# EAGLE design micro_opto_v1.0 (EAGLE 6.4)
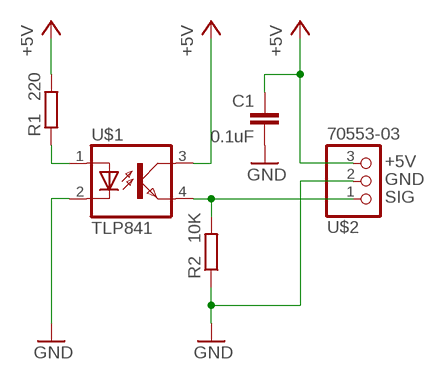
[diagram p0: schematic, sheet 1]

## Parts
C1  0.1uF  C-EUC0805  [C0805]
R1  220  R-EU_R0805  [R0805]
R2  10K  R-EU_R0805  [R0805]
U$1  TLP841  [TLP841]
U$2  70553-03  [70553-03]

## Nets
+5V: C1.1 R1.2 U$1.3(COL) U$2.3
GND: C1.2 R2.1 U$1.2(C) U$2.2
N$2: R1.1 U$1.1(A)
SIG: R2.2 U$1.4(EMIT) U$2.1

## Notes on the sheet
- +5V
- GND
- SIG

## Library data of the parts
C1 = rcl_mod:C-EU: CAPACITOR, European symbol
R1 R2 = rcl_mod:R-EU_: RESISTOR, European symbol
U$1 = TLP841:TLP841
U$2 = 70553-03:70553-03

## Board
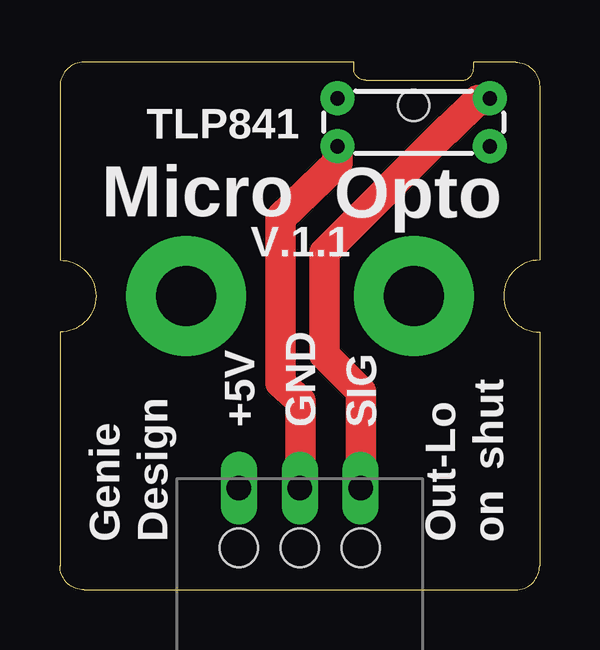
[diagram p1: board, top side]
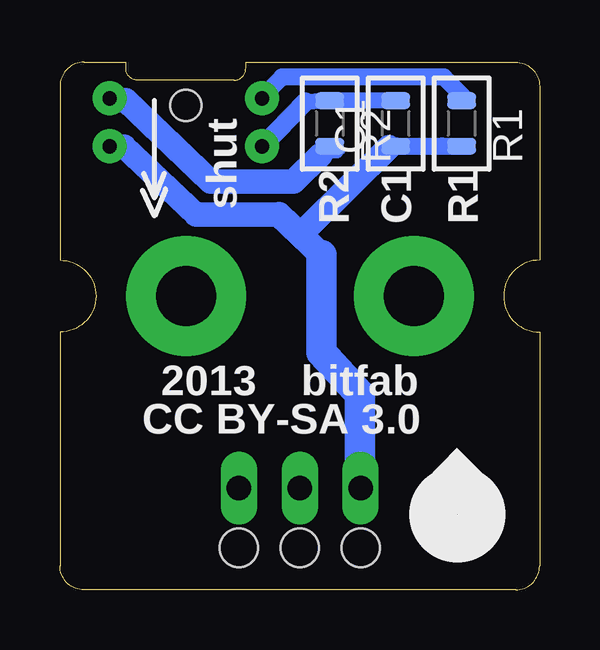
[diagram p2: board, bottom side, seen from below]

Size 20 x 22 mm. Coordinates in mm from the lower left corner, seen from the top.
Outline: 19,22 17.25,22 17.25,21.75 arc-90 16.75,21.25 12.75,21.25 arc-90 12.25,21.75 12.25,22 1,22 arc90 0,21 0,13.75 arc-90 1.5,12.25 arc-90 0,10.75 0,1 arc90 1,0 19,0 arc90 20,1 20,10.75 arc-90 18.5,12.25 arc-90 20,13.75 20,21 arc90 19,22
Copper layers (1*16): Top 0.035mm / dielectric 1.5mm / Bottom 0.035mm
Design rules "Fusion_eagle_rule_v1.1 *": minimum track width 6mil, minimum drill 12mil, track to track 6mil, track to pad 6mil, pad to pad 6mil, via to via 6mil, smd to smd 0mil, copper to edge 10mil, drill to drill 10mil, minimum pad ring 10mil, minimum via ring 6mil, stop-mask expansion 2mil, vias tented up to drill 100mil, thermal gap 10mil
Holes 1.6 mm at 10,1.75 7.46,1.75 12.54,1.75

### Footprints (pad centres in the part's own frame; a part is rotated, then mirrored left to right if it is on the bottom)
C0805 = smd 0.7 x 1.2: 1 -0.95,0; 2 0.95,0
R0805 = smd 0.7 x 1.2: 1 -0.95,0; 2 0.95,0
TLP841 = drill 0.6 pad 1.422: 1 -3.175,1; 2 -3.175,-1; 3 3.175,-1; 4 3.175,1 | hole 1.3: 0,0.7
70553-03 = drill 1.016 long: 1 2.54,0; 2 0,0; 3 -2.54,0

### Placement (x,y rotation side)
C1  6,19.45 90 bottom
R1  3.25,19.45 270 bottom
R2  8.75,19.45 270 bottom
U$1  14.75,19.5 0 top
U$2  10,4.25 0 top

### Tracks (layer width: path | path; a pad name or v marks a point on that pad's centre or on a via)
+5V
  Bottom 0.152: 7.49,5.21 U$2.3 | 9.09,13.97 9.4,14.48 9.65,15.13
  Bottom 0.61: 5.97,18.51 C1.1 6.35,18.51 6.27,18.46
  Bottom 0.711: 5.97,18.51 4.06,18.51 R1.2
  Bottom 1.016: 9.65,15.13 6.27,18.46 | 10.87,15.65 14.33,15.65 17.32,18.49 18.02,18.49
  Bottom 1.067: 9.09,13.97 10.87,15.65
  Bottom 1.27: 7.49,4.5 7.49,5.21 7.49,8.15 9.09,9.91 9.09,13.97 | 18.02,18.49 U$1.3
GND
  Top 1.27: U$1.2 11.57,17.8 9.2,15.49 9.2,8.64 10.03,7.87 10.03,5.18 U$2.2
  Bottom 0.61: 6.1,20.42 C1.2 | 8.64,20.42 R2.1 8.69,20.42 | U$1.2 11.56,18.51
  Bottom 0.66: 8.64,20.42 6.1,20.42 | 9.75,20.36 8.69,20.42
  Bottom 0.762: 11.56,18.51 9.75,20.36
N$1  (via drill 2.5 pad 5)
  other vias: 5.25,12.25
N$2
  Bottom 0.152: R1.1 3.3,20.45 3.19,20.56
  Bottom 0.61: 11.56,20.54 U$1.1
  Bottom 0.711: 3.05,20.42 3.19,20.56 3.99,21.39 10.74,21.39 11.56,20.54
N$3  (via drill 2.5 pad 5)
  other vias: 14.75,12.25
SIG
  Top 0.152: U$2.1 12.57,5.21 12.55,4.5 | 17.42,20.42 18.03,20.45 U$1.4
  Top 1.27: 17.83,20.42 17.42,20.42 16.2,19.2 16.15,19.2 11.02,14.07 11.02,9.8 12.55,8.28 12.55,4.5 12.5,5.08
  Bottom 0.152: R2.2 8.76,18.41 9.14,18.14 | 17.91,20.42 17.91,20.45 U$1.4
  Bottom 0.254: 9.14,18.14 8.38,18.14 8.23,18.29
  Bottom 0.61: R2.2 8.66,18.49
  Bottom 1.016: 17.91,20.42 17.27,20.42 13.72,17.02 10.26,17.02 9.14,18.14

### Text on the board
tPlace: TLP841 | Micro | Opto | V.1.1 | +5V | GND | SIG | shut | Genie | Design | Out-Lo | on
bPlace: shut | R1 | C1 | R2 | bitfab | 2013 | CC BY-SA 3.0
Document: 22mm | 20mm